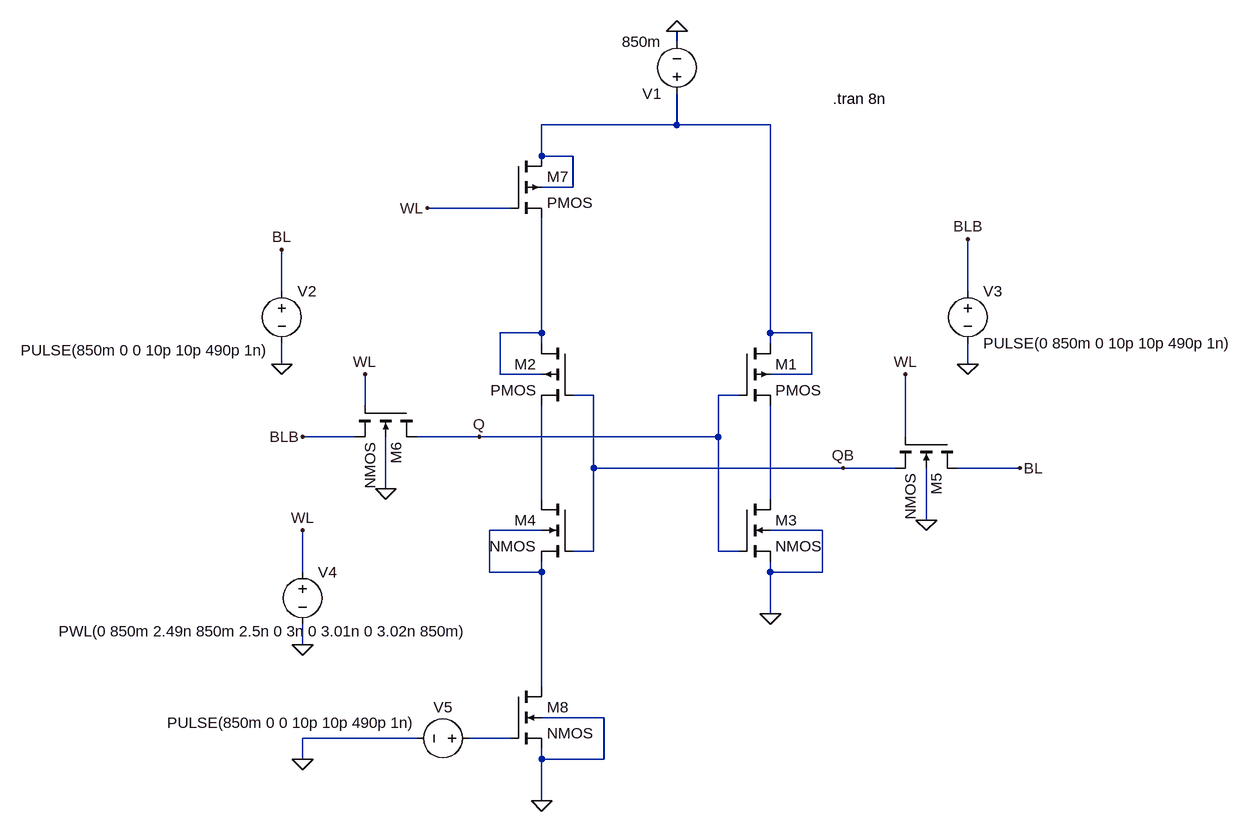
[diagram p0: schematic sram8t.asc]
sram8t.asc, the LTspice schematic file:
Version 4
SHEET 1 1636 4844
WIRE 224 -400 224 -416
WIRE 224 -272 224 -320
WIRE 224 -272 16 -272
WIRE 368 -272 224 -272
WIRE 16 -224 16 -272
WIRE 64 -224 16 -224
WIRE 64 -176 64 -224
WIRE 64 -176 16 -176
WIRE -32 -144 -160 -144
WIRE -384 -16 -384 -80
WIRE 672 -16 672 -96
WIRE 16 48 16 -128
WIRE 16 48 -48 48
WIRE 368 48 368 -272
WIRE 432 48 368 48
WIRE 16 64 16 48
WIRE 368 64 368 48
WIRE -384 96 -384 64
WIRE 672 96 672 64
WIRE -48 112 -48 48
WIRE 16 112 -48 112
WIRE 432 112 432 48
WIRE 432 112 368 112
WIRE 96 144 64 144
WIRE 320 144 288 144
WIRE -256 160 -256 112
WIRE -272 208 -352 208
WIRE -80 208 -176 208
WIRE 288 208 288 144
WIRE 288 208 -80 208
WIRE 576 208 576 112
WIRE 96 256 96 144
WIRE 480 256 96 256
WIRE 560 256 480 256
WIRE 752 256 656 256
WIRE -224 288 -224 208
WIRE 16 304 16 160
WIRE 368 304 368 160
WIRE 608 336 608 256
WIRE 16 352 -64 352
WIRE 448 352 368 352
WIRE 96 384 96 256
WIRE 96 384 64 384
WIRE 288 384 288 208
WIRE 320 384 288 384
WIRE -352 416 -352 352
WIRE -64 416 -64 352
WIRE 16 416 16 400
WIRE 16 416 -64 416
WIRE 368 416 368 400
WIRE 448 416 448 352
WIRE 448 416 368 416
WIRE 368 480 368 416
WIRE -352 528 -352 496
WIRE 16 592 16 416
WIRE 112 640 16 640
WIRE -176 672 -352 672
WIRE -32 672 -96 672
WIRE -352 704 -352 672
WIRE 16 704 16 688
WIRE 112 704 112 640
WIRE 112 704 16 704
WIRE 16 768 16 704
FLAG -224 288 0
FLAG 608 336 0
FLAG 224 -416 0
FLAG -384 96 0
FLAG -352 528 0
FLAG 672 96 0
FLAG -80 208 Q
FLAG 480 256 QB
FLAG 576 112 WL
FLAG -256 112 WL
FLAG 752 256 BL
FLAG -352 208 BLB
FLAG -352 352 WL
FLAG -384 -80 BL
FLAG 672 -96 BLB
FLAG -160 -144 WL
FLAG 368 480 0
FLAG 16 768 0
FLAG -352 704 0
SYMBOL pmos4 320 64 R0
SYMATTR InstName M1
SYMATTR Value2 l=20n w=320n
SYMBOL pmos4 64 64 M0
SYMATTR InstName M2
SYMATTR Value2 l=20n w=320n
SYMBOL nmos4 320 304 R0
SYMATTR InstName M3
SYMATTR Value2 l=20n w=960n
SYMBOL nmos4 64 304 M0
SYMATTR InstName M4
SYMATTR Value2 l=20n w=960n
SYMBOL nmos4 656 208 R90
SYMATTR InstName M5
SYMATTR Value2 l=20n w=128n
SYMBOL nmos4 -176 160 R90
SYMATTR InstName M6
SYMATTR Value2 l=20n w=128n
SYMBOL voltage 224 -304 R180
WINDOW 123 0 0 Left 0
WINDOW 39 0 0 Left 0
SYMATTR InstName V1
SYMATTR Value 850m
SYMBOL voltage -384 -32 R0
WINDOW 3 -17 107 Right 2
WINDOW 123 0 0 Left 0
WINDOW 39 0 0 Left 0
SYMATTR Value PULSE(850m 0 0 10p 10p 490p 1n)
SYMATTR InstName V2
SYMBOL voltage 672 -32 R0
WINDOW 123 0 0 Left 0
WINDOW 39 0 0 Left 0
SYMATTR InstName V3
SYMATTR Value PULSE(0 850m 0 10p 10p 490p 1n)
SYMBOL voltage -352 400 R0
WINDOW 3 260 107 Right 2
WINDOW 123 0 0 Left 0
WINDOW 39 0 0 Left 0
SYMATTR Value PWL(0 850m 2.49n 850m 2.5n 0 3n 0 3.01n 0 3.02n 850m)
SYMATTR InstName V4
SYMBOL pmos4 -32 -224 R0
SYMATTR InstName M7
SYMBOL nmos4 -32 592 R0
SYMATTR InstName M8
SYMBOL voltage -80 672 R90
WINDOW 0 -32 56 VBottom 2
WINDOW 3 -40 288 VTop 2
WINDOW 123 0 0 Left 0
WINDOW 39 0 0 Left 0
SYMATTR InstName V5
SYMATTR Value PULSE(850m 0 0 10p 10p 490p 1n)
TEXT 464 -312 Left 2 !.tran 8n

The netlist it stands for:
* sram8t.asc
M1 N001 Q N004 N001 PMOS l=20n w=320n
M2 N002 QB N003 N002 PMOS l=20n w=320n
M3 N004 Q 0 0 NMOS l=20n w=960n
M4 N003 QB N005 N005 NMOS l=20n w=960n
M5 BL WL QB 0 NMOS l=20n w=128n
M6 Q WL BLB 0 NMOS l=20n w=128n
V1 N001 0 850m
V2 BL 0 PULSE(850m 0 0 10p 10p 490p 1n)
V3 BLB 0 PULSE(0 850m 0 10p 10p 490p 1n)
V4 WL 0 PWL(0 850m 2.49n 850m 2.5n 0 3n 0 3.01n 0 3.02n 850m)
M7 N001 WL N002 N001 PMOS
M8 N005 N006 0 0 NMOS
V5 N006 0 PULSE(850m 0 0 10p 10p 490p 1n)
.model NMOS NMOS
.model PMOS PMOS
.lib standard.mos
.tran 8n
.backanno
.end

* Results of the author's LTspice run, read from the files saved beside the schematic
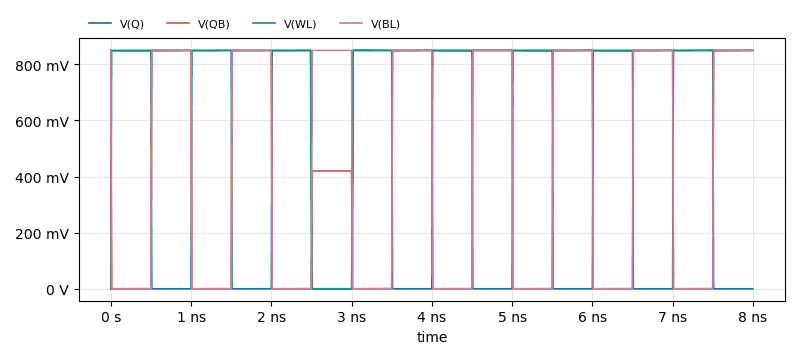
[diagram p1: Transient Analysis of sram8t.asc, plotted from the saved traces]
* Transient Analysis, 1 run:
*   V(Q): min -1.557 µV, max 849.9 mV, average 423.2 mV, rms 597.2 mV, last 0 V
*   V(QB): min -1.891 µV, max 849.9 mV, average 397.9 mV, rms 569.8 mV, last 849.9 mV
*   V(WL): min 0 V, max 850 mV, average 794.8 mV, rms 821.7 mV, last 850 mV
*   V(BL): min 0 V, max 850 mV, average 425 mV, rms 599.2 mV, last 850 mV